# EAGLE design merope-power (EAGLE 6.5.0)
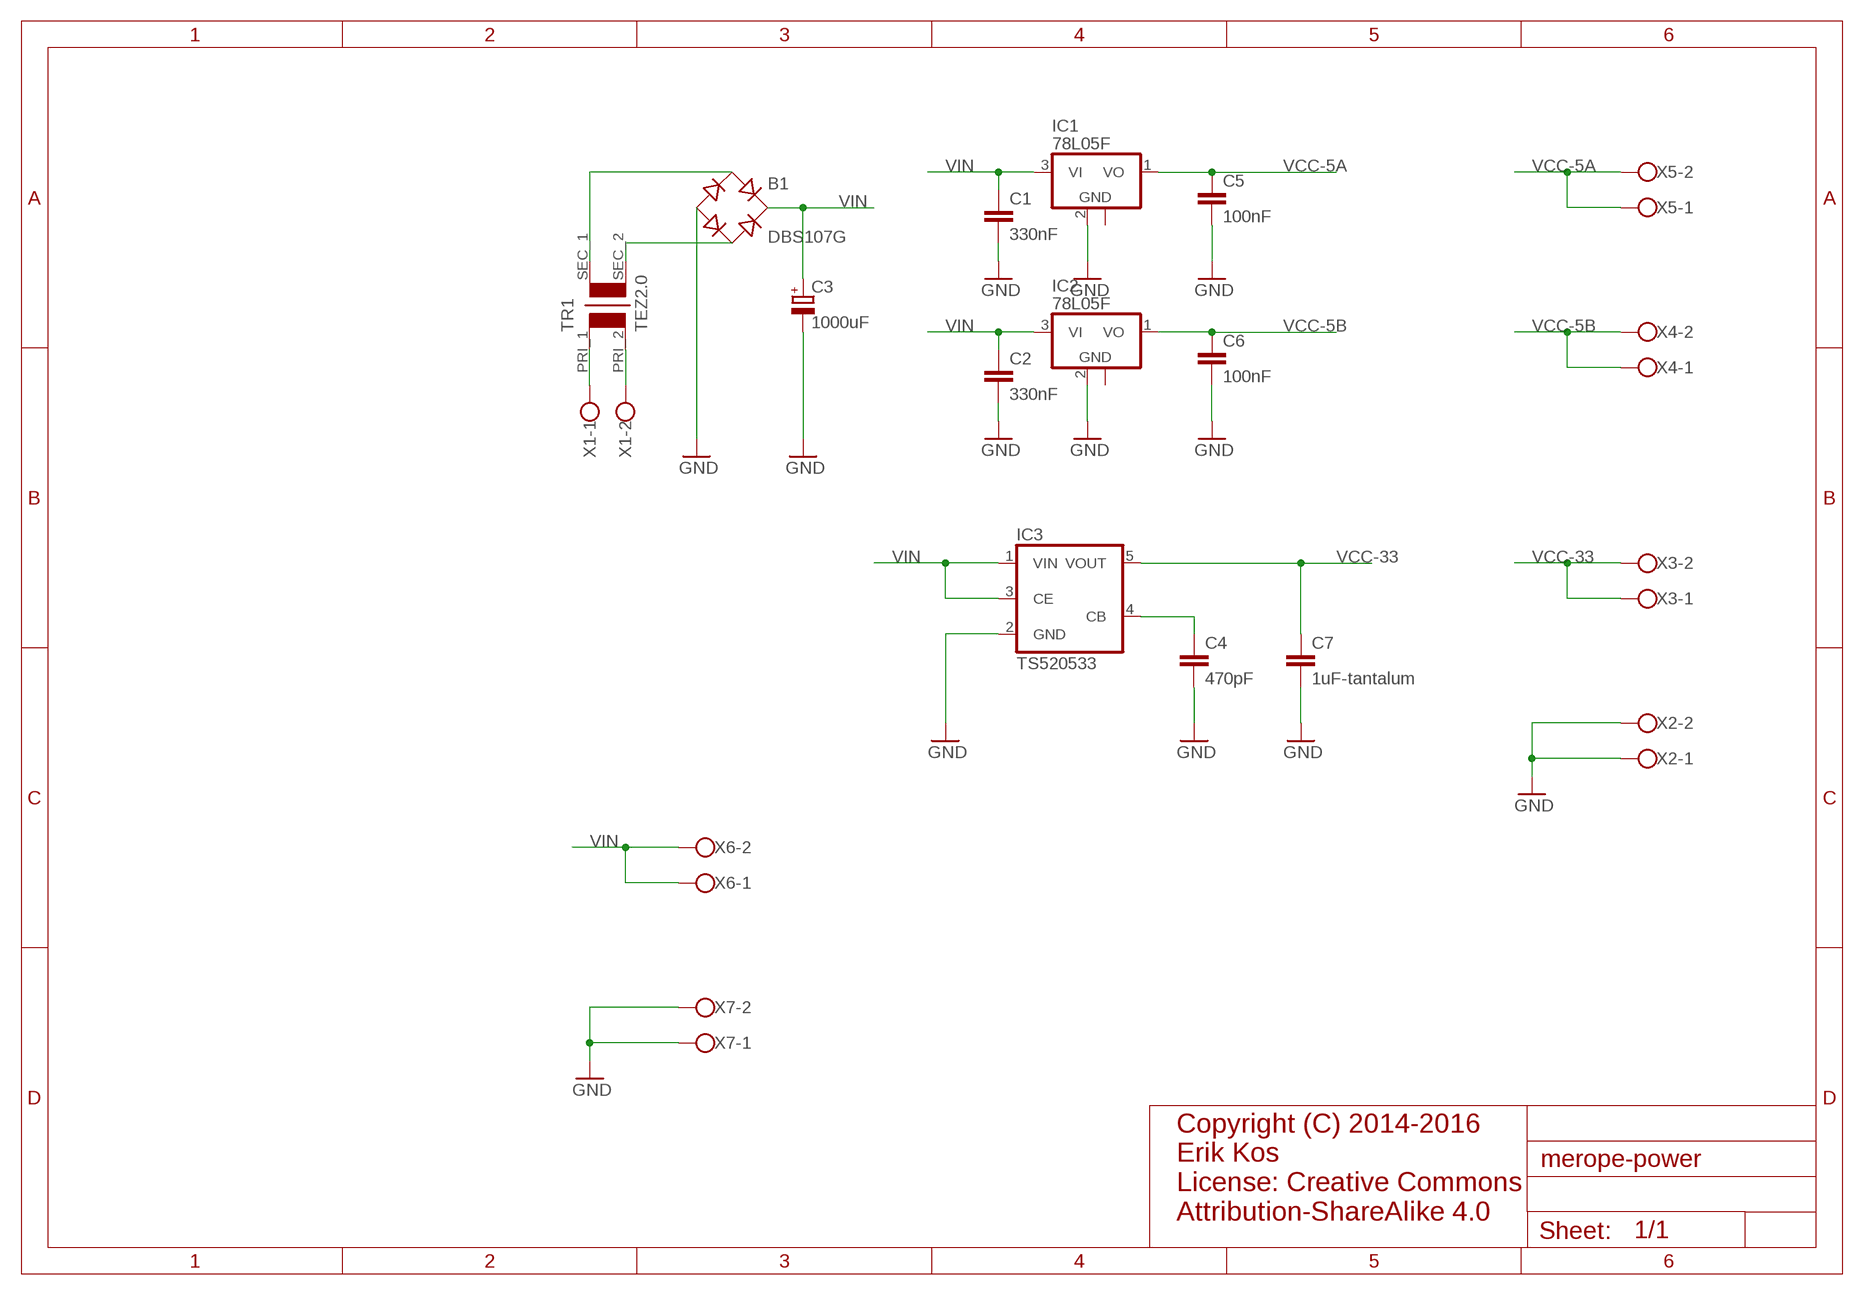
[diagram p0: schematic, sheet 1]

## Parts
B1  DBS107G  [DBS]
C1  330nF  C-EUC0805  [C0805]
C2  330nF  C-EUC0805  [C0805]
C3  1000uF  CPOL-EUTT5D11  [TT5D11]
C4  470pF  C-EUC0805  [C0805]
C5  100nF  C-EUC0805  [C0805]
C6  100nF  C-EUC0805  [C0805]
C7  1uF-tantalum  C-EUC0805  [C0805]
IC1  78L05F  [SOT89]
IC2  78L05F  [SOT89]
IC3  TS520533  [SOT25]
TR1  TEZ2.0  [TEZ2.0]
X1  TERMINAL_BLOCK_5_2  [TERMINAL_BLOCK_5_2]
X2  TERMINAL_BLOCK_35_2  [TERMINAL_BLOCK_35_2]
X3  TERMINAL_BLOCK_35_2  [TERMINAL_BLOCK_35_2]
X4  TERMINAL_BLOCK_35_2  [TERMINAL_BLOCK_35_2]
X5  TERMINAL_BLOCK_35_2  [TERMINAL_BLOCK_35_2]
X6  TERMINAL_BLOCK_35_2  [TERMINAL_BLOCK_35_2]
X7  TERMINAL_BLOCK_35_2  [TERMINAL_BLOCK_35_2]

## Nets
GND [16mils]: B1.- C1.2 C2.2 C3.- C4.2 C5.2 C6.2 C7.2 IC1.2(GND) IC2.2(GND) IC3.2(GND) X2.1 X2.2 X7.1 X7.2
N$1: B1.AC1 TR1.SEC_1
N$3: C4.1 IC3.4(CB)
N$7: B1.AC2 TR1.SEC_2
N$23: TR1.PRI_1 X1.1
N$24: TR1.PRI_2 X1.2
VCC-5A [16mils]: C5.1 IC1.1(VO) X5.1 X5.2
VCC-5B [16mils]: C6.1 IC2.1(VO) X4.1 X4.2
VCC-33: C7.1 IC3.5(VOUT) X3.1 X3.2
VIN: B1.+ C1.1 C2.1 C3.+ IC1.3(VI) IC2.3(VI) IC3.1(VIN) IC3.3(CE) X6.1 X6.2
Unconnected: IC1.2@1(GND) IC2.2@1(GND)

## Notes on the sheet
- Copyright (C) 2014-2016
  Erik Kos
  License: Creative Commons 
  Attribution-ShareAlike 4.0

## Library data of the parts
B1 = rectifier:DB?*G: Single Phase 1.0 AMP Glass Passivated Bridge Rectifier Taiwan Semiconductor Co.,Ltd. - TSC Source: http://www.taiwansemi.com/TSCbig5/ezcatfiles/cust/img/img/db101g.pdf http://www.ts.com.tw/db/pictures/modules/PDT/PDT060207001/DBLS201G.pdf
C1 C2 C4-C7 = rcl:C-EU: CAPACITOR, European symbol
C3 = rcl:CPOL-EU: POLARIZED CAPACITOR, European symbol
IC1 IC2 = linear:78L*: POSITOIV-VOLTAGE REGULATORS Output up to 100 mA Source: http://focus.ti.com/lit/ds/symlink/ua78l05.pdf
IC3 = v-reg:TS5205: 150mA Low Noise LDO Voltage Regulator with Enable TSC [Taiwan Semiconductor Company, Ltd] Source: http://www.taiwansemi.com .. 5205_0409c.pdf
TR1 = js:TEZ2.0
X1 = js:TERMINAL_BLOCK_5_2
X2-X7 = js:TERMINAL_BLOCK_35_2

## Net classes
2 16mils: width 0.406 mm

## Board
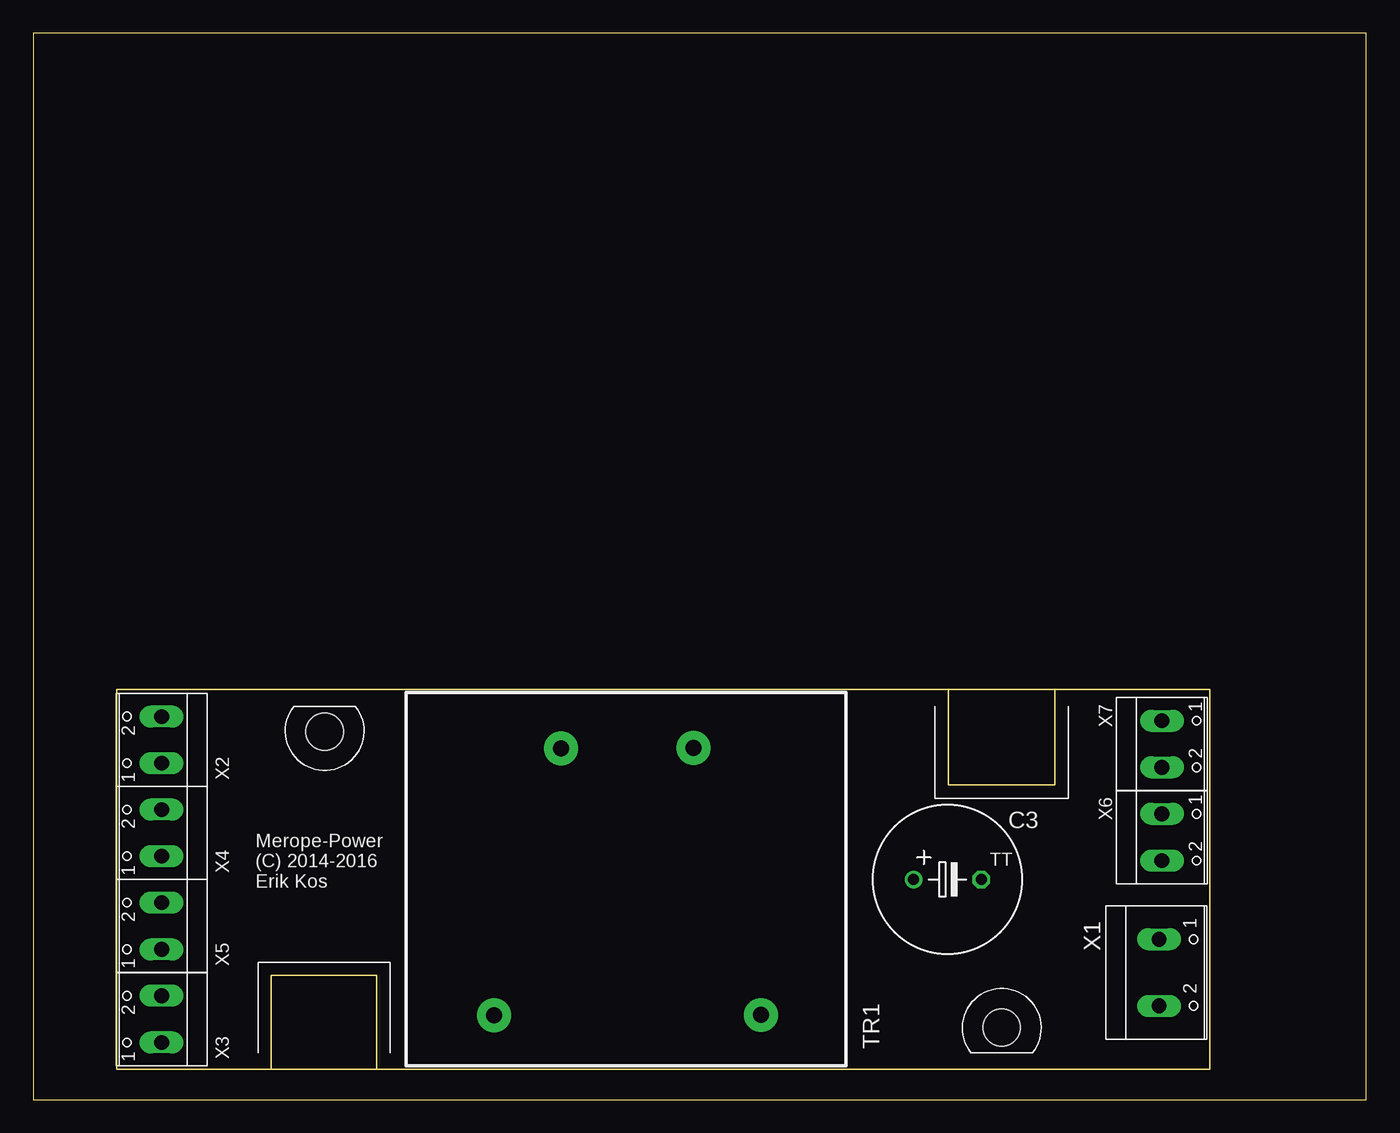
[diagram p1: board, top side]
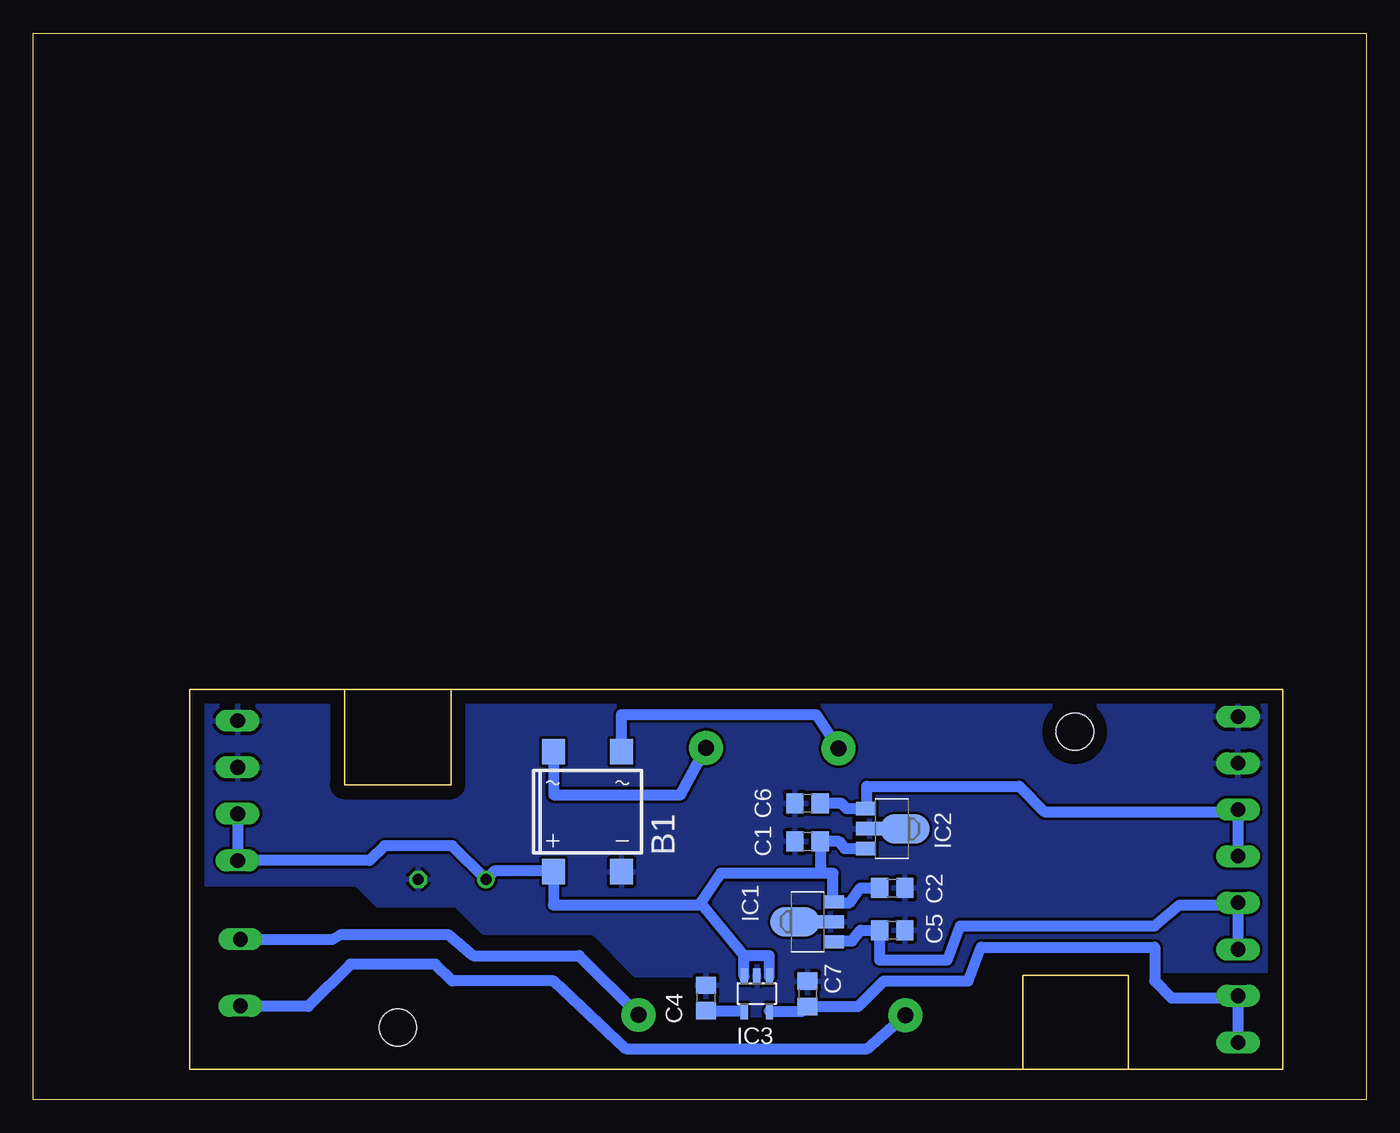
[diagram p2: board, bottom side, seen from below]

Size 100 x 80 mm. Coordinates in mm from the lower left corner, seen from the top.
Outline: 0,0 100,0 100,80 0,80 0,0
Copper layers (1*16): Top 0.035mm / dielectric 1.5mm / Bottom 0.035mm
Design rules "default": minimum track width 10mil, minimum drill 24mil, track to track 8mil, track to pad 8mil, pad to pad 8mil, via to via 8mil, smd to smd 8mil, copper to edge 40mil, drill to drill 8mil, minimum pad ring 10mil, minimum via ring 8mil, stop-mask expansion 4mil, vias tented up to drill 0mil, thermal gap 10mil

### Footprints (pad centres in the part's own frame; a part is rotated, then mirrored left to right if it is on the bottom)
DBS = smd 1.7 x 1.9: + -2.55,-4.5; - 2.55,-4.5; AC1 -2.55,4.5; AC2 2.55,4.5
C0805 = smd 1.3 x 1.5: 1 -0.95,0; 2 0.95,0
TT5D11 = drill 0.813: + -2.54,0 | drill 0.813 octagon: - 2.54,0
SOT89 = smd 1 x 1.5: 1 -1.499,-1.981; 3 1.499,-1.981 | smd 1 x 2: 2 0,-1.727 | smd 2.2 x 3.7: 2@1 0,0.94
SOT25 = smd 0.55 x 1.2: 1 -0.95,-1.3; 2 0,-1.3; 3 0.95,-1.3; 4 0.95,1.3; 5 -0.95,1.3
TEZ2.0 = drill 1.2 pad 2.54: PRI_1 -10.142,8.9; PRI_2 9.868,8.92; SEC_1 -5.086,-11.15; SEC_2 4.858,-11.11
Z-103 = hole 2.8: -26.4,11.1; 24.4,-11.1
TERMINAL_BLOCK_5_2 = drill 1.1 long: 1 -2.5,0; 2 2.5,0
TERMINAL_BLOCK_35_2 = drill 1.1 long: 1 -1.75,-0.1; 2 1.75,-0.1

### Placement (x,y rotation side)
B1  58.42,21.59 0 bottom
C1  41.91,19.37 180 bottom
C2  35.56,15.88 0 bottom
C3  68.58,16.51 0 top
C4  49.53,7.62 90 bottom
C5  35.56,12.7 0 bottom
C6  41.91,22.23 180 bottom
C7  41.91,7.94 90 bottom
IC1  41.91,13.34 90 bottom
IC2  35.56,20.32 270 bottom
IC3  45.72,7.94 180 bottom
TR1  44.45,15.24 180 top
U$1  [Z-103]  48.26,16.51 0 top
X1  84.45,9.53 270 top
X2  9.53,26.99 90 top
X3  9.53,6.03 90 top
X4  9.53,20 90 top
X5  9.53,13.02 90 top
X6  84.77,19.68 270 top
X7  84.77,26.67 270 top

### Tracks (layer width: path | path; a pad name or v marks a point on that pad's centre or on a via)
GND
  pour Bottom: 87.63,30.48 87.95,30.48 87.95,16.35 87.79,16.19 75.72,16.19 74.14,14.61 68.26,14.61 66.2,12.54 57.94,12.54 54.77,9.37 50.16,9.37 50.16,6.35 38.1,6.35 35.88,8.57 29.69,8.57 28.42,10.95 26.35,11.11 16.35,11.11 16.35,9.68 6.51,9.68 6.51,30.64
N$1
  Bottom 0.406: B1.AC1
  Bottom 0.813: B1.AC1 60.96,22.86 51.44,22.86 TR1.SEC_1
N$3
  Bottom 0.406: 47.02,6.67 IC3.4
  Bottom 0.813: C4.1 47.02,6.67
N$7
  Bottom 0.813: B1.AC2 55.88,28.89 41.27,28.89 TR1.SEC_2
N$23
  Bottom 0.813: X1.1 77.51,12.03 76.92,12.38 68.9,12.38 66.99,10.79 59.05,10.79 TR1.PRI_1
N$24
  Bottom 0.813: TR1.PRI_2 37.41,3.81 55.56,3.81 60.96,8.89 68.58,8.89 69.85,10.16 76.2,10.16 79.38,6.99 83.14,6.99 X1.2
VCC-5A
  Bottom 0.406: 9.79,14.61 X5.2
  Bottom 0.813: IC1.1 39.86,11.91 38.58,11.91 37.94,12.7 C5.1 36.51,11.43 36.51,10.48 31.43,10.48 30.48,13.02 15.88,13.02 13.97,14.61 9.79,14.61 | X5.2 X5.1
VCC-5B
  Bottom 0.406: IC2.1 37.47,21.82 | 9.78,21.59 X4.2
  Bottom 0.813: IC2.1 38.96,21.82 39.37,22.23 C6.1 | 37.47,21.82 37.47,23.5 26.04,23.5 24.13,21.59 9.78,21.59 | X4.2 X4.1
VCC-33
  Bottom 0.406: C7.1 | 9.78,7.62 X3.2
  Bottom 0.813: IC3.5 42.26,6.64 C7.1 | C7.1 38.1,6.99 36.2,8.89 29.84,8.89 28.89,11.43 15.88,11.43 15.88,8.89 14.61,7.62 9.78,7.62 | X3.2 X3.1
VIN
  Bottom 0.406: IC1.3 40.01,14.91 | 61.02,17.14 B1.+
  Bottom 0.813: IC2.3 39.12,18.82 39.53,19.37 C1.1 40.96,16.98 40.01,16.99 | IC1.3 39.38,14.76 38.73,14.76 37.94,15.88 C2.1 | 40.01,14.91 40.01,16.99 | 40.01,16.99 48.42,16.99 50.01,14.61 | IC3.1 44.77,10.79 46.67,10.79 | 46.67,10.79 49.85,14.61 50.01,14.61 | IC3.3 46.67,10.79 | B1.+ 60.97,14.61 50.01,14.61 | 61.02,17.14 65.41,17.14 C3.+ 68.58,19.05 73.66,19.05 74.78,17.93 X6.2 X6.1

### Text on the board
tNames: Merope-Power / (C) 2014-2016 / Erik Kos